# EAGLE design 1.6 (EAGLE 7.5.0)
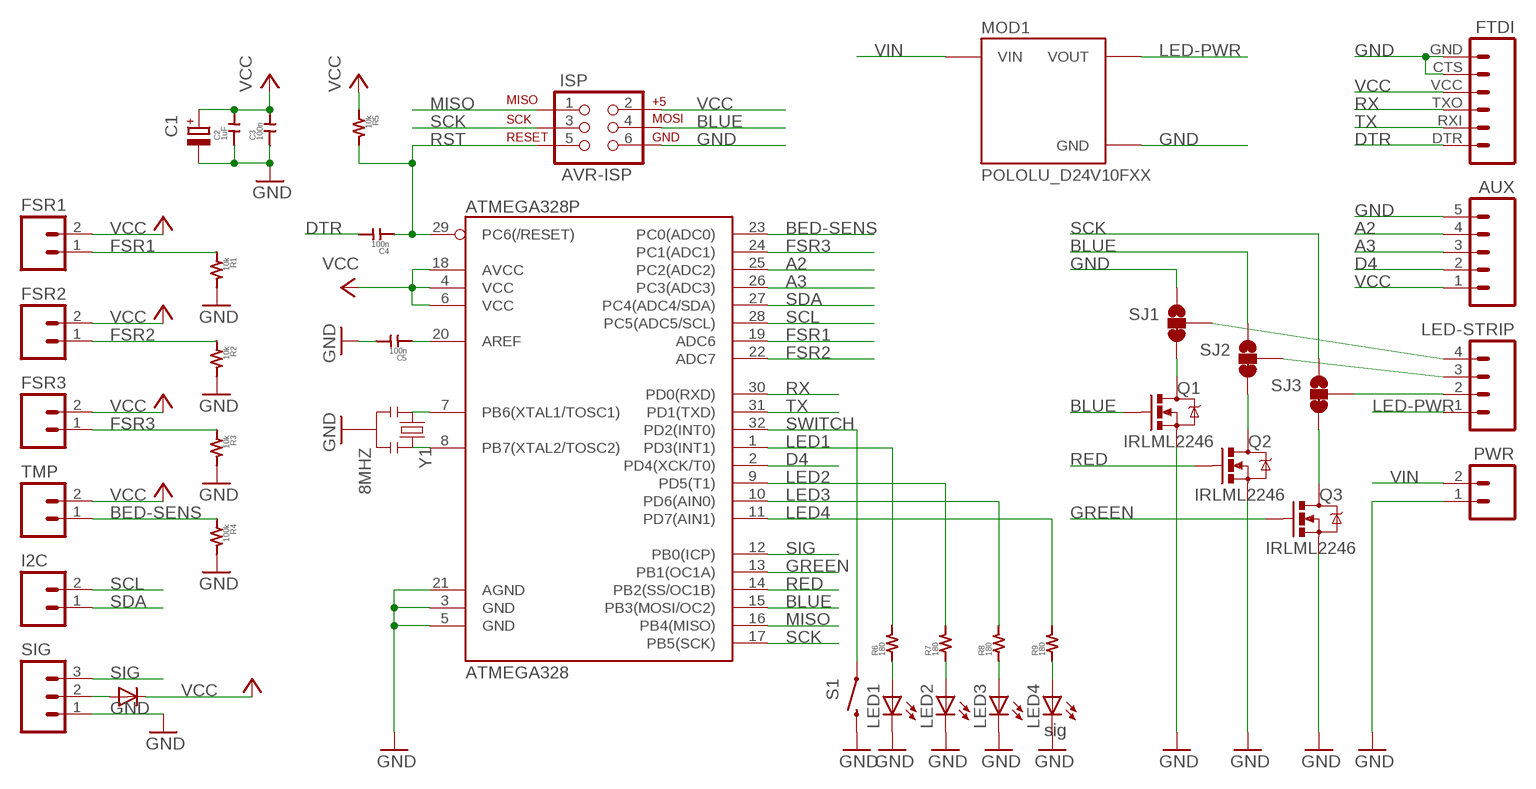
[diagram p0: schematic, sheet 1]

## Parts
ATMEGA328  ATMEGA328P  ATMEGA328_SMT  [TQFP32-08]
AUX  M05PTH  [1X05]
C1  CPOL-EUSMCB  [SMC_B]
C2  1uF  CAP0603  [0603]
C3  100n  CAP0603  [0603]
C4  100n  CAP0603  [0603]
C5  100n  CAP0603  [0603]
D1  MBR0520LT  [SOD123]
FSR1  M02PTH  [1X02]
FSR2  M02PTH  [1X02]
FSR3  M02PTH  [1X02]
FTDI  FTDI_BASICPTH  [FTDI_BASIC]
I2C  M02PTH  [1X02]
ISP  AVR-ISP  AVR_SPI_PRG_62X3_LOCK  [2X3_LOCK]
LED1  LED3MM  [LED3MM]
LED2  LED3MM  [LED3MM]
LED3  LED3MM  [LED3MM]
LED4  sig  LED3MM  [LED3MM]
LED-STRIP  M04PTH  [1X04]
MOD1  POLOLU_D24V10FXX  [POLOLU_D24V10FXX_3PIN]
PWR  M02PTH  [1X02]
Q1  IRLML2246  MOSFET-NCHANNELBSS138  [SOT23]
Q2  IRLML2246  MOSFET-NCHANNELBSS138  [SOT23]
Q3  IRLML2246  MOSFET-NCHANNELBSS138  [SOT23]
R1  10k  RES0603  [0603]
R2  10k  RES0603  [0603]
R3  10k  RES0603  [0603]
R4  100k  RES0603  [0603]
R5  10k  RES0603  [0603]
R6  180  RES0603  [0603]
R7  180  RES0603  [0603]
R8  180  RES0603  [0603]
R9  180  RES0603  [0603]
S1  SWITCH-MOMENTARY-2SMD  [TACTILE_SWITCH_SMD]
SIG  M03PTH  [1X03]
SJ1  JUMPER-PAD-3-2OF3_NC_BY_TRACE  [PAD-JUMPER-3-2OF3_NC_BY_TRACE_YES_SILK_FULL_BOX]
SJ2  JUMPER-PAD-3-2OF3_NC_BY_TRACE  [PAD-JUMPER-3-2OF3_NC_BY_TRACE_YES_SILK_FULL_BOX]
SJ3  JUMPER-PAD-3-2OF3_NC_BY_TRACE  [PAD-JUMPER-3-2OF3_NC_BY_TRACE_YES_SILK_FULL_BOX]
TMP  M02PTH  [1X02]
Y1  8MHZ  RESONATOR8MHZ  [RESONATOR-SMD]

## Nets
A2: ATMEGA328.25(PC2(ADC2)) AUX.4
A3: ATMEGA328.26(PC3(ADC3)) AUX.3
AREF: ATMEGA328.20(AREF) C5.1
BED-SENS: ATMEGA328.23(PC0(ADC0)) R4.1 TMP.1
BLUE: ATMEGA328.15(PB3(MOSI/OC2)) ISP.4 Q1.1(G) SJ2.1
D4: ATMEGA328.2(PD4(XCK/T0)) AUX.2
DTR: C4.2 FTDI.DTR
FSR1: ATMEGA328.19(ADC6) FSR1.1 R1.1
FSR2: ATMEGA328.22(ADC7) FSR2.1 R2.1
FSR3: ATMEGA328.24(PC1(ADC1)) FSR3.1 R3.1
GND [pwr]: ATMEGA328.3(GND) ATMEGA328.5(GND) ATMEGA328.21(AGND) AUX.5 C1.- C2.1 C3.1 C5.2 FTDI.CTS FTDI.GND ISP.6 LED1.K(C) LED2.K(C) LED3.K(C) LED4.K(C) MOD1.GND PWR.1 Q1.2(S) Q2.2(S) Q3.2(S) R1.2 R2.2 R3.2 R4.2 S1.3 S1.4 SIG.1 SJ1.1 Y1.2
GREEN: ATMEGA328.13(PB1(OC1A)) Q3.1(G)
LED1: ATMEGA328.1(PD3(INT1)) R6.2
LED2: ATMEGA328.9(PD5(T1)) R7.2
LED3: ATMEGA328.10(PD6(AIN0)) R8.2
LED4: ATMEGA328.11(PD7(AIN1)) R9.2
LED-PWR: LED-STRIP.1 MOD1.VOUT
MISO: ATMEGA328.16(PB4(MISO)) ISP.1
N$1: LED1.A R6.1
N$2: LED2.A R7.1
N$3: LED3.A R8.1
N$4: LED4.A R9.1
N$5 [pwr]: Q1.3(D) SJ1.3
N$6 [pwr]: Q2.3(D) SJ2.3
N$7: D1.A SIG.2
N$8 [pwr]: Q3.3(D) SJ3.3
N$10: ATMEGA328.8(PB7(XTAL2/TOSC2)) Y1.3
N$11: ATMEGA328.7(PB6(XTAL1/TOSC1)) Y1.1
N$12 [pwr]: LED-STRIP.3 SJ2.2
N$14 [pwr]: LED-STRIP.4 SJ1.2
N$16 [pwr]: LED-STRIP.2 SJ3.2
RED: ATMEGA328.14(PB2(SS/OC1B)) Q2.1(G)
RST: ATMEGA328.29(PC6(/RESET)) C4.1 ISP.5 R5.2
RX: ATMEGA328.30(PD0(RXD)) FTDI.TXO
SCK: ATMEGA328.17(PB5(SCK)) ISP.3 SJ3.1
SCL: ATMEGA328.28(PC5(ADC5/SCL)) I2C.2
SDA: ATMEGA328.27(PC4(ADC4/SDA)) I2C.1
SIG: ATMEGA328.12(PB0(ICP)) SIG.3
SWITCH: ATMEGA328.32(PD2(INT0)) S1.1 S1.2
TX: ATMEGA328.31(PD1(TXD)) FTDI.RXI
VCC [pwr]: ATMEGA328.4(VCC) ATMEGA328.6(VCC) ATMEGA328.18(AVCC) AUX.1 C1.+ C2.2 C3.2 D1.C FSR1.2 FSR2.2 FSR3.2 FTDI.VCC ISP.2 R5.1 TMP.2
VIN [pwr]: MOD1.VIN PWR.2

## Library data of the parts
ATMEGA328 = SparkFun-DigitalIC:ATMEGA328_SMT: 32-Pin Atmega328 part Commonly used on Arduino compatible boards Available in QFP and QFN packages TQFP is IC-09069 QFN is non-stock; PROD_ID: IC-09069
AUX = SparkFun-Connectors:M05: Header 5 Standard 5-pin 0.1" header. Use with straight break away headers (SKU : PRT-00116), right angle break away headers (PRT-00553), swiss pins (PRT-00743), machine pins (PRT-00117), and female headers (PRT-00115). Molex polarized connector foot print use with SKU : PRT-08230 with associated crimp pins and housings.
C1 = rcl:CPOL-EU: POLARIZED CAPACITOR, European symbol
C2-C5 = _sg_lib:CAP0603
D1 = diode:MBR0520LT: SCHOTTKY BARRIER RECTIFIER Source: http://onsemi.com .. MBR0520LT1-D.pdf
FSR1-FSR3 I2C PWR TMP = SparkFun-Connectors:M02: Header 2 Standard 2-pin 0.1" header. Use with straight break away headers (SKU : PRT-00116), right angle break away headers (PRT-00553), swiss pins (PRT-00743), machine pins (PRT-00117), and female headers (PRT-00115). Molex polarized connector foot print use with SKU : PRT-08233 with associated crimp pins and housings.
FTDI = SparkFun-Connectors:FTDI_BASIC: FTDI Basic header with labels
ISP = SparkFun-Connectors:AVR_SPI_PRG_6: AVR ISP 6 Pin This is the reduced ISP connector for AVR programming. Common on Arduino. This footprint will take up less PCB space and can be used with a 10-pin to 6-pin adapter such as SKU: BOB-08508
LED1-LED4 = led:LED: LED OSRAM: - CHIPLED LG R971, LG N971, LY N971, LG Q971, LY Q971, LO R971, LY R971 LH N974, LH R974 LS Q976, LO Q976, LY Q976 LO Q996 - Hyper CHIPLED LW Q18S LB Q993, LB Q99A, LB R99A - SideLED LS A670, LO A670, LY A670, LG A670, LP A670 LB A673, LV A673, LT A673, LW A673 LH A674 LY A675 LS A676, LA A676, LO A676, LY A676, LW A676 LS A679, LY A679, LG A679 - Hyper Micro SIDELED® LS Y876, LA Y876, LO Y876, LY Y876 LT Y87S - SmartLED LW L88C, LW L88S LB L89C, LB L89S, LG L890 LS L89K, LO L89K, LY L89K LS L896, LA L896, LO L896, LY L896 - TOPLED LS T670, LO T670, LY T670, LG T670, LP T670 LSG T670, LSP T670, LSY T670, LOP T670, LYG T670 LG T671, LOG T671, LSG T671 LB T673, LV T673, LT T673, LW T673 LH T674 LS T676, LA T676, LO T676, LY T676, LB T676, LH T676, LSB T676, LW T676 LB T67C, LV T67C, LT T67C, LS T67K, LO T67K, LY T67K, LW E67C LS E67B, LA E67B, LO E67B, LY E67B, LB E67C, LV E67C, LT E67C LW T67C LS T679, LY T679, LG T679 LS T770, LO T770, LY T770, LG T770, LP T770 LB T773, LV T773, LT T773, LW T773 LH T774 LS E675, LA E675, LY E675, LS T675 LS T776, LA T776, LO T776, LY T776, LB T776 LHGB T686 LT T68C, LB T68C - Hyper Mini TOPLED® LB M676 - Mini TOPLED Santana® LG M470 LS M47K, LO M47K, LY M47K Source: http://www.osram.convergy.de LUXEON: - LUMILED® LXK2-PW12-R00, LXK2-PW12-S00, LXK2-PW14-U00, LXK2-PW14-V00 LXK2-PM12-R00, LXK2-PM12-S00, LXK2-PM14-U00 LXK2-PE12-Q00, LXK2-PE12-R00, LXK2-PE12-S00, LXK2-PE14-T00, LXK2-PE14-U00 LXK2-PB12-K00, LXK2-PB12-L00, LXK2-PB12-M00, LXK2-PB14-N00, LXK2-PB14-P00, LXK2-PB14-Q00 LXK2-PR12-L00, LXK2-PR12-M00, LXK2-PR14-Q00, LXK2-PR14-R00 LXK2-PD12-Q00, LXK2-PD12-R00, LXK2-PD12-S00 LXK2-PH12-R00, LXK2-PH12-S00 LXK2-PL12-P00, LXK2-PL12-Q00, LXK2-PL12-R00 Source: www.luxeon.com KINGBRIGHT: KA-3528ASYC Source: www.kingbright.com
LED-STRIP = SparkFun-Connectors:M04: Header 4 Standard 4-pin 0.1" header. Use with straight break away headers (SKU : PRT-00116), right angle break away headers (PRT-00553), swiss pins (PRT-00743), machine pins (PRT-00117), and female headers (PRT-00115). Molex polarized connector foot print use with SKU : PRT-08231 with associated crimp pins and housings. 1MM SMD Version SKU: PRT-10208
MOD1 = _hhn_Pololu_test:POLOLU_D24V10FXX: Pololu Adjustable Step Down Voltage Regulators Series D24V3A_V (600 mA) 0.4"x0.6" SOURCE www.pololu.com/ PACKAGE THT; 4-pin (0.1"); 0.4"x0.6" TECHNOLOGIES D24V3A…V Vi = (4.5…42)V Vo/V (Vo < Vi) X: (generic) L: (2.5… 7.5) H: (4.0…25.0) Io: 600 mA; Quiescent Current: 2 mA (SHDN: 20 uA) Author: Dipl.-Ing. FH Rainer Bayer
Q1-Q3 = SparkFun-DiscreteSemi:MOSFET-NCHANNEL: Common NMOSFET Parts MFG P/N Store ID Prod ID FDD8780 TRANS-09984 SI7820DN TRANS-11055 FDS6630A IC-08089 2N7002PW TRANS-11151 FQP30N06L COM-10213 TRANS-10060 BSS123LT1G TRANS-08345 BSS138 TRANS-00830 BS170 2N7000; PROD_ID: TRANS-00830
R1-R9 = _sg_lib:RES0603
S1 = SparkFun-Electromechanical:SWITCH-MOMENTARY-2: Various NO switches- pushbuttons, reed, etc
SIG = SparkFun-Connectors:M03: Header 3 Standard 3-pin 0.1" header. Use with straight break away headers (SKU : PRT-00116), right angle break away headers (PRT-00553), swiss pins (PRT-00743), machine pins (PRT-00117), and female headers (PRT-00115). Molex polarized connector foot print use with SKU : PRT-08232 with associated crimp pins and housings.
SJ1-SJ3 = SparkFun-Passives:JUMPER-PAD-3-2OF3_NC_BY_TRACE
Y1 = SparkFun-FreqCtrl:RESONATOR: Resonator Small SMD resonator. Used, eg, on the Arduino Pro/ Pro Mini boards. 8MHz- XTAL-08895 16MHz- XTAL-08900; PROD_ID: XTAL-08895

## Net classes
1 pwr: width 0.406 mm

## Board
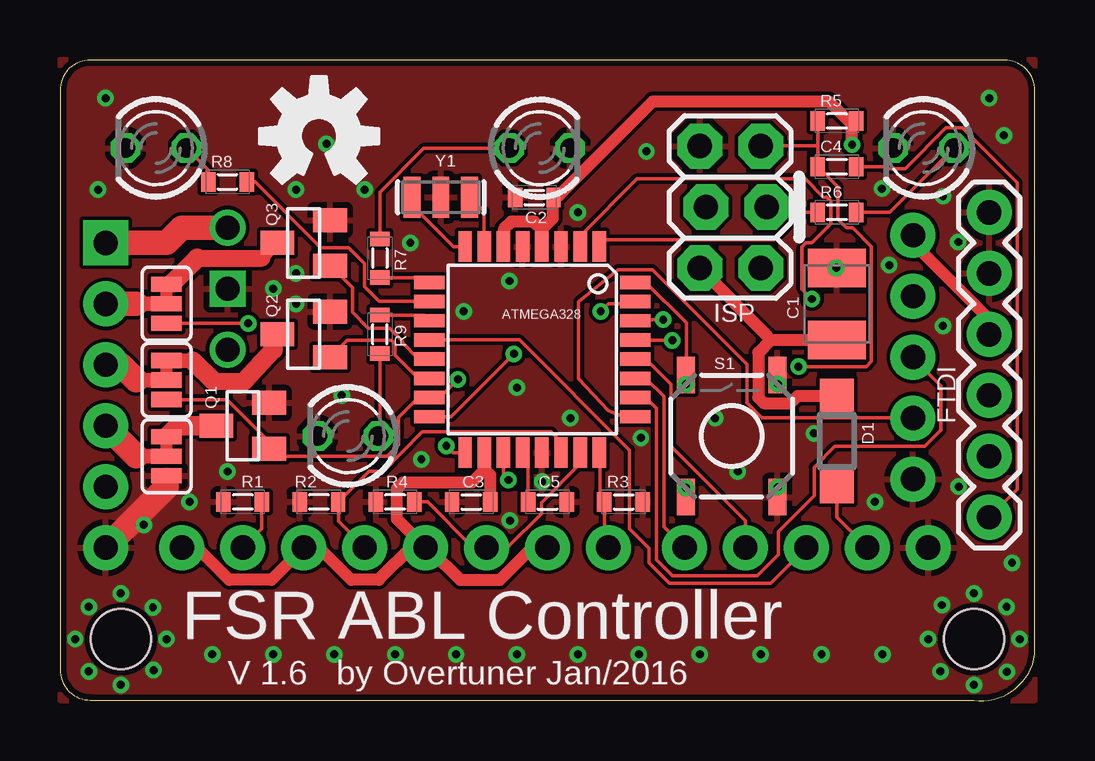
[diagram p1: board, top side]
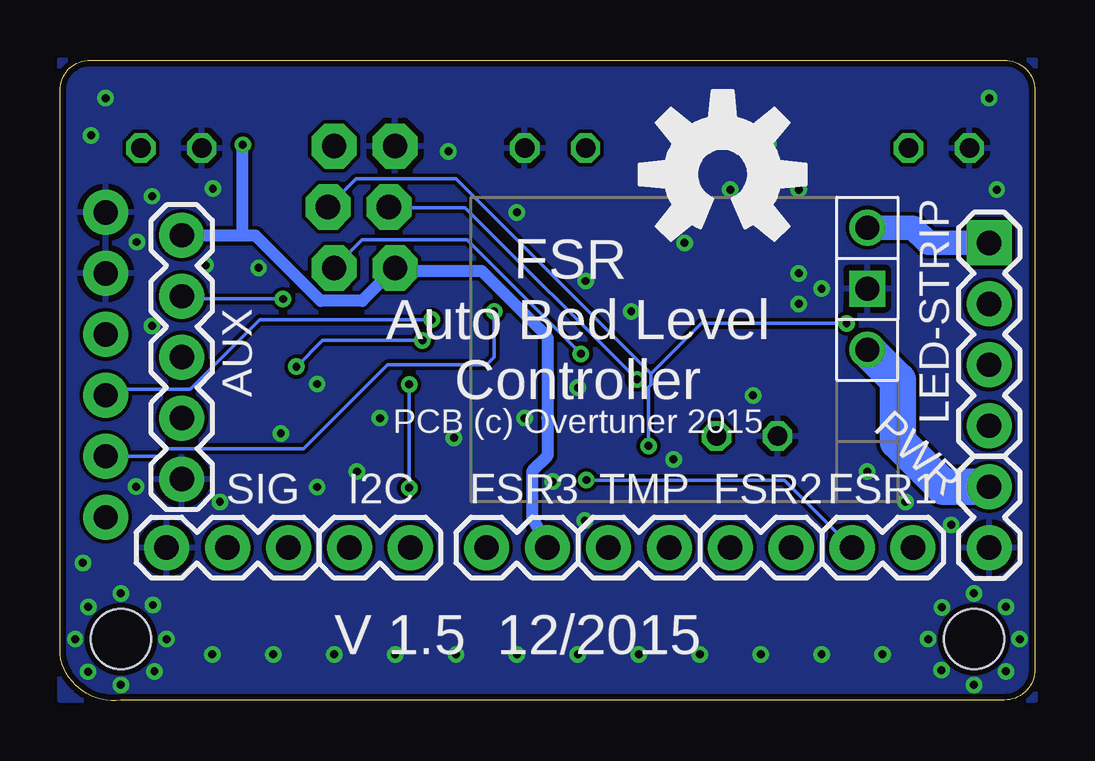
[diagram p2: board, bottom side, seen from below]

Size 40.64 x 26.69 mm. Coordinates in mm from the lower left corner, seen from the top.
Outline: 0,25.42 0,1.29 arc90 1.27,0.02 38.1,0.02 arc90 40.64,1.93 40.64,25.42 arc90 39.37,26.69 1.27,26.69 arc90 0,25.42
Copper layers (1*16): Top 0.0356mm / dielectric 1.5011mm / Bottom 0.0356mm
Design rules "LaenPCBOrder (2) *": minimum track width 6mil, minimum drill 13mil, track to track 6mil, track to pad 6mil, pad to pad 6mil, via to via 6mil, smd to smd 6mil, copper to edge 10mil, drill to drill 6mil, minimum pad ring 7mil, minimum via ring 7mil, stop-mask expansion 3mil, vias tented up to drill 13mil, thermal gap 10mil
Holes 2.5 mm at 2.54,2.56 38.1,2.56

### Footprints (pad centres in the part's own frame; a part is rotated, then mirrored left to right if it is on the bottom)
TQFP32-08 = smd 1.27 x 0.559: 1 -4.293,2.8; 2 -4.293,2; 3 -4.293,1.2; 4 -4.293,0.4; 5 -4.293,-0.4; 6 -4.293,-1.2; 7 -4.293,-2; 8 -4.293,-2.8; 17 4.293,-2.8; 18 4.293,-2; 19 4.293,-1.2; 20 4.293,-0.4; 21 4.293,0.4; 22 4.293,1.2; 23 4.293,2; 24 4.293,2.8 | smd 0.559 x 1.27: 9 -2.8,-4.293; 10 -2,-4.293; 11 -1.2,-4.293; 12 -0.4,-4.293; 13 0.4,-4.293; 14 1.2,-4.293; 15 2,-4.293; 16 2.8,-4.293; 25 2.8,4.293; 26 2,4.293; 27 1.2,4.293; 28 0.4,4.293; 29 -0.4,4.293; 30 -1.2,4.293; 31 -2,4.293; 32 -2.8,4.293
1X05 = drill 1.016 pad 1.88: 1 0,0; 2 2.54,0; 3 5.08,0; 4 7.62,0; 5 10.16,0
SMC_B = smd 1.6 x 2.4: + -1.5,0; - 1.5,0
0603 = smd 0.6 x 0.8: 1 -0.8,0; 2 0.8,0
SOD123 = smd 1.4 x 1.4: A 1.9,0; C -1.9,0
1X02 = drill 1.016 pad 1.88: 1 0,0; 2 2.54,0
FTDI_BASIC = drill 1.016 pad 1.88: CTS 10.16,0; DTR 0,0; GND 12.7,0; RXI 2.54,0; TXO 5.08,0; VCC 7.62,0
2X3_LOCK = drill 1.016 pad 1.88 octagon: 1 0,0; 2 0,2.54; 3 2.54,-0.254; 4 2.54,2.286; 5 5.08,0; 6 5.08,2.54
LED3MM = drill 0.813 octagon: A -1.27,0; K 1.27,0
1X04 = drill 1.016 pad 1.88 square: 1 0,0 | drill 1.016 pad 1.88: 2 2.54,0; 3 5.08,0; 4 7.62,0
POLOLU_D24V10FXX_3PIN = drill 1 square: GND 3.81,-8.89 | drill 1: VIN 1.27,-8.89; VOUT 6.35,-8.89
SOT23 = smd 1 x 1.4: 1 -0.95,-1.1; 2 0.95,-1.1; 3 0,1.1
TACTILE_SWITCH_SMD = smd 1.524 x 0.762: 1 -2.54,1.905; 2 2.54,1.905; 3 -2.54,-1.905; 4 2.54,-1.905
1X03 = drill 1.016 pad 1.88: 1 0,0; 2 2.54,0; 3 5.08,0
PAD-JUMPER-3-2OF3_NC_BY_TRACE_YES_SILK_FULL_BOX = smd 0.635 x 1.27: 1 -0.813,0; 2 0,0; 3 0.813,0
RESONATOR-SMD = smd 0.7 x 1.7: 1 -1.2,0; 2 0,0; 3 1.2,0

### Placement (x,y rotation side)
ATMEGA328  19.68,14.63 270 top
AUX  35.56,19.39 270 bottom
C1  32.38,16.53 90 top
C2  19.77,20.96 0 top
C3  17.14,8.28 0 top
C4  32.38,22.25 0 top
C5  20.32,8.28 0 top
D1  32.38,10.82 270 top
FSR1  7.62,6.37 0 bottom
FSR2  12.7,6.37 0 bottom
FSR3  22.86,6.37 0 bottom
FTDI  38.73,7.64 90 top
I2C  26.04,6.37 180 bottom
ISP  29.21,18.02 90 top
LED1  36,23.02 180 top
LED2  20,23.02 0 top
LED3  4,23.02 180 top
LED4  12,11.02 180 top
LED-STRIP  1.91,19.07 270 bottom
MOD1  15.88,13.36 90 bottom
PWR  1.91,6.37 90 bottom
Q1  7.62,11.45 90 top
Q2  10.16,15.26 90 top
Q3  10.16,19.07 90 top
R1  7.62,8.28 180 top
R2  10.79,8.28 180 top
R3  23.5,8.28 0 top
R4  13.97,8.28 180 top
R5  32.38,24.15 180 top
R6  32.38,20.34 180 top
R7  13.34,18.44 270 top
R8  6.99,21.61 0 top
R9  13.34,15.26 90 top
S1  28,11.02 90 top
SIG  36.2,6.37 0 bottom
SJ1  4.45,10.18 90 top
SJ2  4.45,13.36 90 top
SJ3  4.45,16.53 90 top
TMP  17.78,6.37 0 bottom
U$1  [OSHW-LOGO-M]  10.79,23.52 0 top
U$2  [OSHW-LOGO-L]  13.02,21.93 0 bottom
Y1  15.88,20.98 180 top

### Tracks (layer width: path | path; a pad name or v marks a point on that pad's centre or on a via)
A2
  Top 0.152: ATMEGA328.25 23.52,11.83 22.86,12.09 21.61,13.42 21.61,16.62 23.27,17.95 24.69,17.95 28.63,14.02 28.63,12.42 29.26,11.78 AUX.4
A3
  Top 0.152: ATMEGA328.26 23.98,12.62 24.43,12.62 24.87,12.19 24.87,5.86 25.53,5.2 29.08,5.2 29.95,6.07 29.95,7.03 31.45,8.53 31.45,9.72 32.31,10.59 36.04,10.59 36.73,11.27 36.73,13.13 35.56,14.3 AUX.3
AREF
  Top 0.152: C5.1 19.51,8.28 19.51,10.13 19.3,10.33 ATMEGA328.20
BED-SENS
  Top 0.152: R4.1 15.32,8.28 17.22,6.37 TMP.1 17.83,6.42 18.69,6.42 20.07,7.79 20.07,8.25 21.67,9.85 21.67,10.33 ATMEGA328.23
BLUE  (via drill 0.33)
  Top 0.152: SJ2.1 6.96,12.54 8.71,10.79 Q1.1 8.79,10.46 9.07,10.18 13.64,10.18 14.12,10.66 14.12,11.81 14.94,12.62 15.39,12.62 ATMEGA328.15 15.44,12.67 15.88,12.67 v16.59,13.38
  Bottom 0.152: v16.59,13.38 23.75,20.54 26.92,20.54 ISP.4
D4  (via drill 0.33)
  Top 0.152: v31.34,16.73 30.94,17.14 30.94,18.92 31.09,19.07 31.34,19.07 32.13,19.86 32.13,20.82 31.98,20.98 31.83,20.98 31.06,21.74 24.05,21.74 21.69,19.38 21.69,18.92 ATMEGA328.2
  Bottom 0.152: v31.34,16.73 35.46,16.73 35.56,16.84 AUX.2
DTR
  Top 0.152: C4.2 34.31,22.25 34.39,22.17 35.23,22.17 36.93,23.87 37.62,23.87 39.9,21.59 39.9,8.81 FTDI.DTR
FSR1  (via drill 0.33)
  Top 0.152: FSR1.1 8.41,7.16 8.41,8.28 R1.1 | v18.69,9.19 18.49,9.39 ATMEGA328.19
  Bottom 0.152: v18.69,9.19 10.44,9.19 FSR1.1
FSR2
  Top 0.152: FSR2.1 11.61,7.46 R2.1 11.66,8.33 12.88,9.55 13.49,9.55 15.09,11.2 20.47,11.2 20.88,10.79 ATMEGA328.22
FSR3
  Top 0.152: FSR3.1 22.71,6.52 R3.1 22.66,8.33 22.5,8.48 22.5,10.33 ATMEGA328.24
GND  (via drill 0.33)
  Top 0.508: 4.45,8.91 SJ1.1
  Top 1.016: PWR.1 4.45,8.91
  Bottom 0.508: FTDI.GND 38.68,20.29 | 38.68,17.88 FTDI.CTS
  other vias: 1.91,25.1 6.35,1.93 2.54,4.47 18.73,17.48 38.73,25.1 39.69,5.74 33.97,8.28 19.05,13.04 21.27,11.77 16.83,16.21 14.61,19.07 34.26,21.33 29.92,13.19 32.36,18.03 36.8,21.01 34.57,18.14 36.8,15.62 37.44,19.11 39.34,23.55 11.75,12.72 6.99,9.55 3.49,7.32 9.84,16.53 9.84,21.29 12.7,21.29 9.84,17.8 8.89,17.17 11.11,23.2 1.59,21.29 1.21,3.91 1.21,1.21 3.9,1.27 4.45,2.56 0.64,2.56 3.87,3.88 2.54,0.66 38.1,4.47 38.1,0.66 40.01,2.56 36.2,2.56 36.77,3.98 39.46,3.91 39.47,1.2 36.7,1.21 37.47,8.91 5.4,8.28 8.89,1.93 11.43,1.93 13.97,1.93 16.51,1.93 19.05,1.93 21.59,1.93 24.13,1.93 26.67,1.93 29.21,1.93 31.75,1.93 34.29,1.93 29.92,8.9 24.22,10.94 20.1,9.13 18.76,7.5 15.06,10.05 24.45,22.88 21.59,20.34 28.26,9.55 27.3,11.77 31.43,11.13
  pour Bottom: 0,0.02 40.64,0.02 40.64,26.69 0,26.69
  pour Top: 40.64,26.69 0,26.69 0,0.02 40.64,0.02
GREEN
  Top 0.152: ATMEGA328.13 15.39,14.24 14.94,14.24 14.28,14.9 14.28,14.98 13.74,15.51 12.85,15.51 12.19,16.17 12.19,17.19 11.28,18.11 Q3.1
LED1
  Top 0.152: R6.2 30.91,20.34 29.77,19.2 22.78,19.2 22.5,18.92 ATMEGA328.1
LED2
  Top 0.152: R7.2 15.21,17.62 15.39,17.44 ATMEGA328.9
LED3
  Top 0.152: R8.2 8.13,21.61 10.87,18.87 12.04,18.87 12.7,18.21 12.7,17.24 13.31,16.63 ATMEGA328.10
LED4
  Top 0.152: R9.2 13.34,16.05 15.19,16.05 15.39,15.84 ATMEGA328.11
LED-PWR
  Top 1.016: LED-STRIP.1 4.45,19.07 5.08,19.71 MOD1.VOUT
  Bottom 1.016: LED-STRIP.1 4.45,19.07 5.08,19.71 MOD1.VOUT
MISO  (via drill 0.33)
  Top 0.152: v18.92,14.45 16.31,11.83 ATMEGA328.16
  Bottom 0.152: v18.92,14.45 23.67,19.2 28.04,19.2 ISP.1
N$1
  Top 0.152: R6.1 34.59,20.34 37.26,23.01 LED1.A
N$2
  Top 0.152: R7.1 13.34,21.18 15.16,23.01 18.72,23.01 LED2.A
N$3
  Top 0.152: R8.1 6.17,21.61 6.17,22.12 5.28,23.01 LED3.A
N$4
  Top 0.152: R9.1 13.34,11.09 13.28,11.04 LED4.A
N$5
  Top 0.813: Q1.3 4.9,11.45 SJ1.3
N$6
  Top 0.508: 8.89,15.09 Q2.3
  Top 0.61: SJ2.3 5.54,14.17
  Top 0.711: 6.4,13.3 7.67,13.3
  Top 0.762: 5.54,14.17 6.4,13.3 | 7.67,13.3 8.89,14.63
  Top 0.813: 8.89,14.63 8.89,15.09
N$7
  Top 0.152: D1.A 32.38,7.64 SIG.2
N$8
  Top 0.508: SJ3.3 4.7,17.42 | 8.43,18.44 Q3.3
  Top 0.711: 5.71,18.44 8.43,18.44
  Top 0.813: 4.7,17.42 5.71,18.44
N$9
  Bottom 0.152: 26.09,13.17 26.09,8.86
N$10
  Top 0.152: ATMEGA328.8 16.41,18.92 14.68,20.65 Y1.3
N$11
  Top 0.152: ATMEGA328.7 17.68,20.39 17.09,20.98 Y1.1
N$12
  Top 0.508: SJ2.2 4.45,13.99
  Top 0.61: 3.17,13.36 SJ2.2
  Top 1.016: LED-STRIP.3 2.54,13.99 3.17,13.36
N$14
  Top 0.508: SJ1.2 4.45,10.82
  Top 0.61: 3.17,10.18 SJ1.2
  Top 1.016: LED-STRIP.4 3.17,10.18
N$16
  Top 0.508: SJ3.2 4.45,17.17
  Top 0.61: 3.17,16.53 SJ3.2
  Top 1.016: LED-STRIP.2 3.17,16.53
RED
  Top 0.152: ATMEGA328.14 14.94,13.43 13.97,14.4 13.97,14.85 13.82,15.01 11.96,15.01 11.28,14.32 Q2.1
RST  (via drill 0.33)
  Top 0.152: 31.6,23.11 31.6,24.15 R5.2 | 31.6,23.11 31.6,22.25 C4.1 31.65,22.19 32.44,21.41 32.44,20.06 32.79,19.71 33.05,19.71 33.83,18.92 33.83,14.14 33.6,13.91 v30.79,13.91 | v25.53,15.01 23.98,15.01 ATMEGA328.29 | 31.6,23.11 29.23,23.11 ISP.5
  Bottom 0.152: v25.53,15.01 29.69,15.01 v30.79,13.91
RX  (via drill 0.33)
  Top 0.152: v25.15,15.87 24,15.87 ATMEGA328.30
  Bottom 0.152: v25.15,15.87 32.31,15.87 35.2,12.97 38.48,12.97 FTDI.TXO
SCK  (via drill 0.33)
  Top 0.152: ATMEGA328.17 16.38,10.33 v16.1,10.61 | v7.85,15.72 SJ3.1
  Bottom 0.152: v16.1,10.61 16.1,13.05 16,13.15 16,13.61 | 16,13.61 24.13,21.74 28.3,21.74 ISP.3 | v7.85,15.72 13.89,15.72 16,13.61
SCL
  Top 0.152: I2C.2 28.57,7.49 25.48,10.59 25.48,13.18 24.43,14.22 ATMEGA328.28
SDA
  Top 0.152: I2C.1 25.17,7.23 25.17,12.67 24.43,13.41 23.98,13.41 ATMEGA328.27
SIG
  Top 0.152: SIG.3 29.64,4.9 25.4,4.9 24.56,5.74 24.56,6.35 23.75,7.16 23.75,10.43 19.15,15.03 ATMEGA328.12
SWITCH  (via drill 0.33)
  Top 0.152: ATMEGA328.32 24.43,17.42 26.11,15.74 26.11,13.58 S1.2 v26.09,13.18 | v26.09,8.86 S1.1
TX  (via drill 0.33)
  Top 0.152: v22.54,16.21 22.86,16.53 23.81,16.53 ATMEGA328.31
  Bottom 0.152: v22.54,16.21 22.54,14.31 22.86,13.99 26.99,13.99 30.48,10.5 36.2,10.5 36.51,10.18 FTDI.RXI
VCC  (via drill 0.33)
  Top 0.508: FSR1.2 5.71,6.37 7.06,5.02 8.81,5.02 FSR2.2 10.39,6.24 10.92,6.24 12.14,5.02 13.28,5.02 14.76,6.5 TMP.2 | 17.7,9.62 17.93,9.39 17.93,8.28 C3.2 | 17.7,9.62 17.7,10.33 ATMEGA328.18 | 17.7,9.62 17.17,9.09 14.3,9.09 14.05,8.83 14.05,7.56 TMP.2 | FSR3.2 19.68,6.37 18.34,5.02 16.69,5.02 15.47,6.24 TMP.2 | 20.09,19.63 20.55,20.09 20.55,20.95 C2.2 20.8,21.05 24.71,24.96 32.05,24.96 32.87,24.15 R5.1 33.02,23.92 v33.02,23.16 | 20.09,19.63 20.09,18.92 ATMEGA328.4 | ATMEGA328.6 18.49,19.63 18.82,19.96 19.76,19.96 20.09,19.63 | FTDI.VCC 38.73,15.9 35.56,19.07 AUX.1 | 29.62,15.01 29.11,14.5 29.11,12.62 29.34,12.39 30.45,12.39 30.76,12.7 32.38,12.7 D1.C | 29.62,15.01 32.38,15.01 C1.+ | 29.62,15.01 29.46,15.21 26.67,18 ISP.2
  Bottom 0.406: 20.32,11.88 20.32,11.77
  Bottom 0.508: 33.02,19.38 32.49,19.38 29.77,16.66 28.04,16.66 26.7,18 ISP.2 26.44,17.9 23.06,17.9 20.32,15.16 20.32,11.77 20.32,10.18 20.95,9.55 20.95,7.64 FSR3.2 | 33.02,19.38 35.56,19.38 AUX.1 | 33.02,19.38 v33.02,23.16
VIN
  Bottom 1.524: PWR.2 3.81,8.91 5.71,10.82 5.71,13.36 MOD1.VIN

### Text on the board
tPlace: FSR ABL Controller | V 1.6 by Overtuner Jan/2016
bPlace: FSR / Auto Bed Level / Controller | PCB (c) Overtuner 2015 | V 1.5 12/2015
Measures: bed | bed-mount